# Altium schematic sheet pa_main6.SchDoc: mcHF QRP Transceiver RF board
size A4; Author: K Atanassov; CompanyName: M0NKA; Revision: 0.6.3; SheetTotal: 12
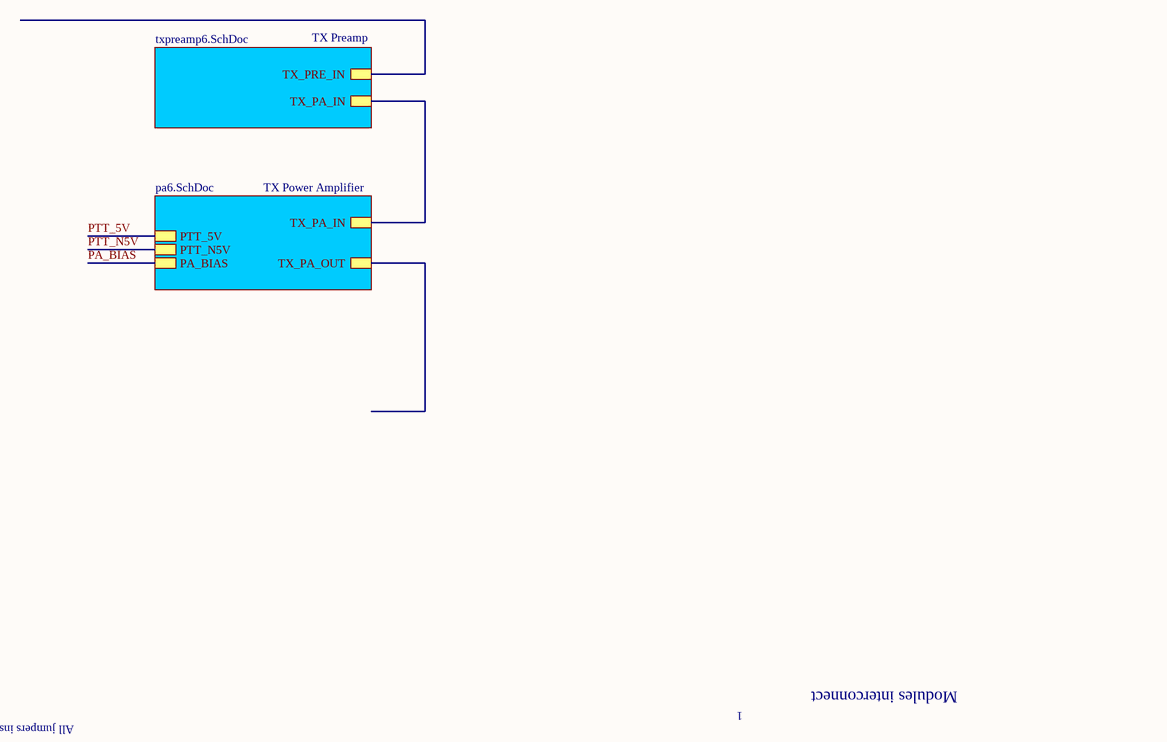
[diagram p0: pa_main6.SchDoc]

## Sub-sheets
TX Power Amplifier = pa6.SchDoc: TX_PA_IN, PA_BIAS, TX_PA_OUT, PTT_N5V, PTT_5V
TX Preamp = txpreamp6.SchDoc: TX_PRE_IN, TX_PA_IN

## Nets
PA_BIAS: sheet TX Power Amplifier/PA_BIAS
PTT_5V: sheet TX Power Amplifier/PTT_5V
PTT_N5V: sheet TX Power Amplifier/PTT_N5V
(unnamed): sheet TX Power Amplifier/TX_PA_IN, sheet TX Preamp/TX_PA_IN

## Notes on the sheet
- All jumpers installed by default, remove selectively to bypass modules during testing
- 1
- Modules interconnect
- Date:
- Revision:
- Sheet
- of
- File: